# Altium schematic sheet Sheet_1_2021-12-15.schdoc
size 271 x 190 mm
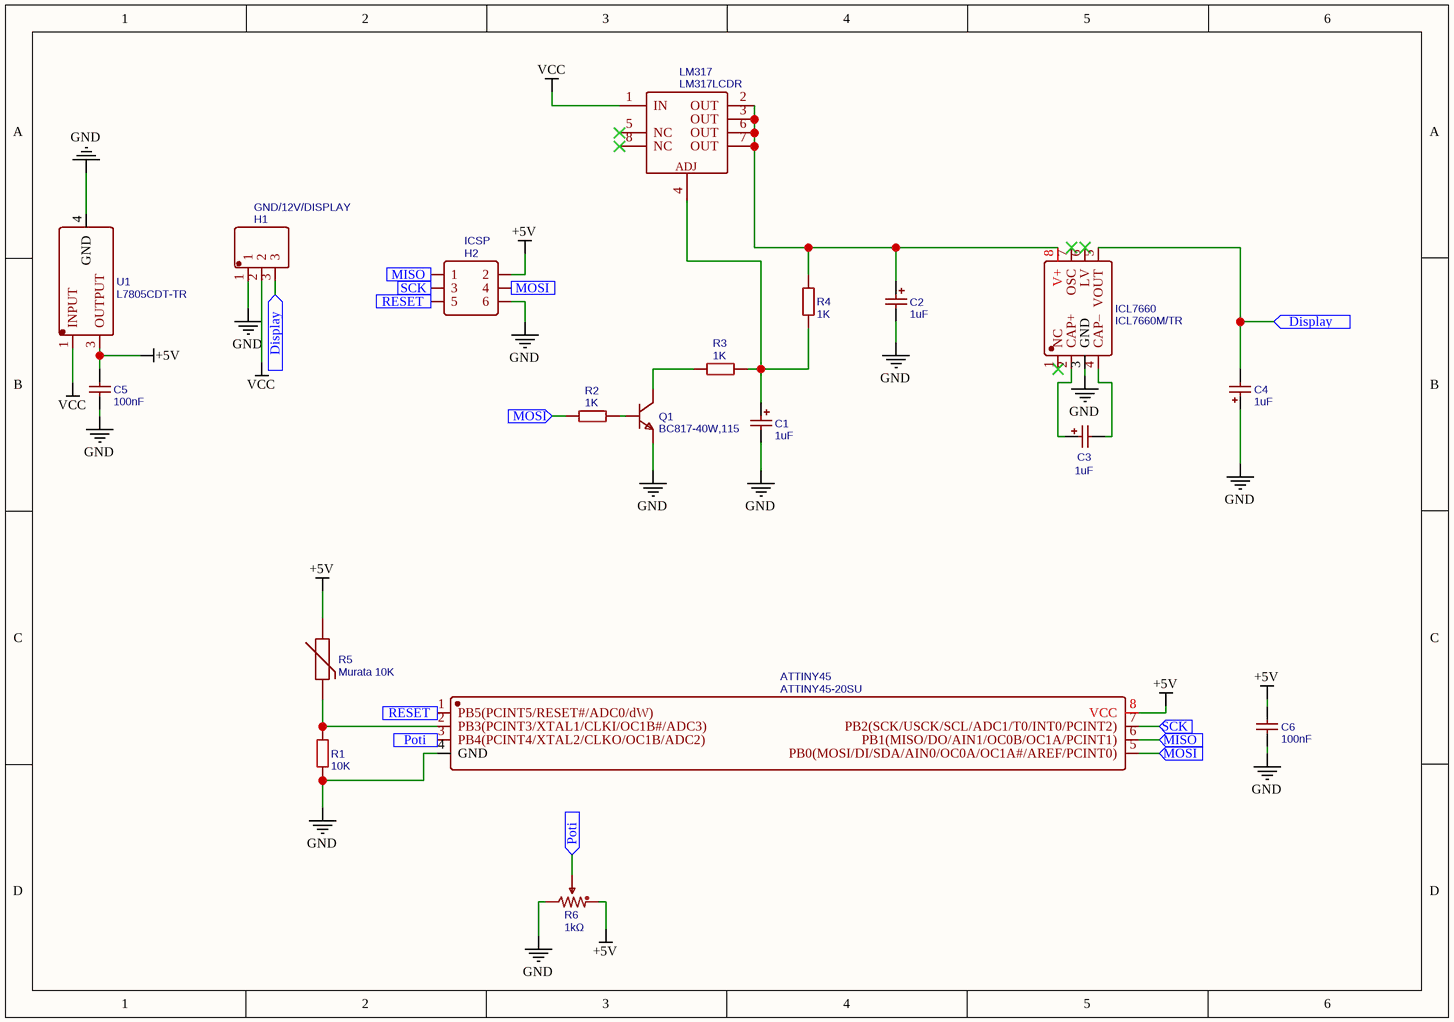
[diagram p0: Sheet_1_2021-12-15.schdoc]

## Parts
ATTINY45  ATTINY45-20SU  [SOIC-8_L5.3-W5.3-P1.27-LS8.0-BL]
C1  1uF  [CAP-SMD_L6.0-W3.2-R-RD]
C2  1uF  [CAP-SMD_L6.0-W3.2-R-RD]
C3  1uF  [CAP-SMD_L6.0-W3.2-R-RD]
C4  1uF  [CAP-SMD_L6.0-W3.2-R-RD]
C5  100nF  [C1206]
C6  100nF  [C1206]
GND/12V/DISPLAY  H1  [HDR-TH_3P-P2.54-V-M-1]
ICL7660  ICL7660M/TR  [SOP-8_L4.9-W3.9-P1.27-LS6.0-BL]
ICSP  H2  [HDR-TH_6P-P2.54-V-M-R2-C3-S2.54-1]
LM317  LM317LCDR  [SOIC-8_L4.9-W3.9-P1.27-LS6.0-BL]
Q1  BC817-40W,115  [SOT-323-3_L2.2-W1.3-P1.30-LS2.2-BR]
R1  10K  [R0805]
R2  1K  [R0805]
R3  1K  [R0805]
R4  1K  [R0805]
R5  Murata 10K  [RES-TH_L4.0-W2.0-P2.54-D0.7]
R6  1kΩ  [RES-ADJ-SMD_3314G-1-103E]
U1  L7805CDT-TR  [DPAK_L6.5-W6.0-P2.29-LS9.9-TL]

## Ports
Display (in), MISO (in), MOSI (in), Poti (in), RESET (in), SCK (in)

## Nets
+5V: ATTINY45.8(VCC) C5.2 C6.2 ICSP.2 R5.2 R6.1 U1.3(OUTPUT)
GND: ATTINY45.4(GND) C1.2 C2.2 C4.1 C5.1 C6.1 GND/12V/DISPLAY.1 ICL7660.3(GND) ICSP.6 Q1.2 R1.1 R6.3 U1.4(GND)
VCC: GND/12V/DISPLAY.2 LM317.1(IN) U1.1(INPUT)
Display: C4.2 GND/12V/DISPLAY.3 ICL7660.5(VOUT) ; port Display
MISO: ATTINY45.6(PB1(MISO/DO/AIN1/OC0B/OC1A/PCINT1)) ICSP.1 ; port MISO
MOSI: ATTINY45.5(PB0(MOSI/DI/SDA/AIN0/OC0A/OC1A#/AREF/PCINT0)) ICSP.4 R2.1 ; port MOSI
Poti: ATTINY45.3(PB4(PCINT4/XTAL2/CLKO/OC1B/ADC2)) R6.2 ; port Poti
RESET: ATTINY45.1(PB5(PCINT5/RESET#/ADC0/dW)) ICSP.5 ; port RESET
SCK: ATTINY45.7(PB2(SCK/USCK/SCL/ADC1/T0/INT0/PCINT2)) ICSP.3 ; port SCK
NetATTINY45_2: ATTINY45.2(PB3(PCINT3/XTAL1/CLKI/OC1B#/ADC3)) R1.2 R5.1
NetC1_1: C1.1 LM317.4(ADJ) R3.2 R4.1
NetC2_1: C2.1 ICL7660.8(V+) LM317.2(OUT) LM317.3(OUT) LM317.6(OUT) LM317.7(OUT) R4.2
NetC3_1: C3.1 ICL7660.2(CAP+)
NetC3_2: C3.2 ICL7660.4(CAP–)
NetQ1_1: Q1.1 R2.2
NetQ1_3: Q1.3 R3.1

Not connected (* = marked no-connect by the designer): ICL7660 1(NC)* 6(LV)* 7(OSC)*; LM317 5(NC)* 8(NC)*

## Library data of the parts
ATTINY45 = ATTINY45-20SU: BOM_Manufacturer: MICROCHIP; Contributor: LCSC; BOM_Supplier: LCSC; BOM_Manufacturer Part: ATTINY45-20SU; BOM_Supplier Part: C62689; BOM_JLCPCB Part Class: Extended Part; spicePre: U; spiceSymbolName: ATTINY45-20SU
C1-C4 = 1uF: BOM_Manufacturer: VISHAY; BOM_Manufacturer Part: 293D105X9050C2TE3; nameAlias: Capacitance; BOM_Supplier: LCSC; BOM_Supplier Part: C130371; BOM_JLCPCB Part Class: Extended Part; spicePre: C; spiceSymbolName: 293D105X9050C2TE3
C5 C6 = 100nF: BOM_Manufacturer: HEC; BOM_Manufacturer Part: C1206N104J050T; nameAlias: Capacitance; BOM_Supplier: LCSC; BOM_Supplier Part: C105970; BOM_JLCPCB Part Class: Extended Part; spicePre: C; spiceSymbolName: C1206N104J050T
GND/12V/DISPLAY = H1: BOM_Manufacturer: Ckmtw; BOM_Manufacturer Part: 210S-1*3P L=11.6MMGold-plated black; Contributor: LCSC; BOM_Supplier: LCSC; BOM_Supplier Part: C124376; BOM_JLCPCB Part Class: Extended Part; spicePre: H; spiceSymbolName: 210S-1*3P L=11.6MMGold-plated black
ICL7660 = ICL7660M/TR: BOM_Manufacturer: HGSEMI; Contributor: LCSC; BOM_Supplier: LCSC; BOM_Supplier Part: C356724; BOM_Manufacturer Part: ICL7660M/TR; BOM_JLCPCB Part Class: Extended Part; spicePre: U; spiceSymbolName: ICL7660M/TR
ICSP = H2: BOM_Manufacturer: BOOMELE; BOM_Manufacturer Part: Header-Male-2.54_2x3; BOM_Supplier: LCSC; BOM_Supplier Part: C65114; BOM_JLCPCB Part Class: Extended Part; spicePre: J; spiceSymbolName: Header-Male-2.54_2x3
LM317 = LM317LCDR: BOM_Manufacturer: TI; BOM_Supplier: LCSC; BOM_Manufacturer Part: LM317LCDR; BOM_Supplier Part: C105219; BOM_JLCPCB Part Class: Extended Part; spicePre: U; spiceSymbolName: LM317LCDR
Q1 = BC817-40W,115: BOM_Manufacturer: Nexperia; BOM_Supplier: LCSC; BOM_Manufacturer Part: BC817-40W,115; BOM_Supplier Part: C75565; BOM_JLCPCB Part Class: Extended Part; spicePre: Q; spiceSymbolName: BC817-40W,115
R1 = 10K: BOM_Manufacturer: Ever Ohms Tech; BOM_Manufacturer Part: TR0805B10KP0525; nameAlias: Resistance (Ohms); Contributor: LCSC; BOM_Supplier: LCSC; BOM_Supplier Part: C188360; BOM_JLCPCB Part Class: Extended Part; spicePre: R; spiceSymbolName: TR0805B10KP0525
R2-R4 = 1K: BOM_Manufacturer: Uniroyal Elec; BOM_Manufacturer Part: 0805WAD1001T5E; nameAlias: Resistance (Ohms); Contributor: LCSC; BOM_Supplier: LCSC; BOM_Supplier Part: C169072; BOM_JLCPCB Part Class: Extended Part; spicePre: R; spiceSymbolName: 0805WAD1001T5E
R5 = Murata 10K: BOM_Manufacturer: Murata Electronics; BOM_Manufacturer Part: NXRT15XH103FA1B030; nameAlias: Value; Contributor: LCSC; BOM_Supplier: LCSC; BOM_Supplier Part: C152559; BOM_JLCPCB Part Class: Extended Part; spicePre: R; spiceSymbolName: NXRT15XH103FA1B030
R6 = 1kΩ: BOM_Manufacturer: BOURNS; BOM_Manufacturer Part: 3314G-1-503E; nameAlias: Resistance; Contributor: LCSC; BOM_Supplier: LCSC; BOM_Supplier Part: C719184; BOM_JLCPCB Part Class: Extended Part; spicePre: R; spiceSymbolName: 3314G-1-503E
U1 = L7805CDT-TR: BOM_Manufacturer: STMicroelectronics; Contributor: LCSC; BOM_Supplier: LCSC; BOM_Supplier Part: C310413; BOM_Manufacturer Part: L7805CDT-TR; BOM_JLCPCB Part Class: Extended Part; spicePre: U; spiceSymbolName: L7805CDT-TR